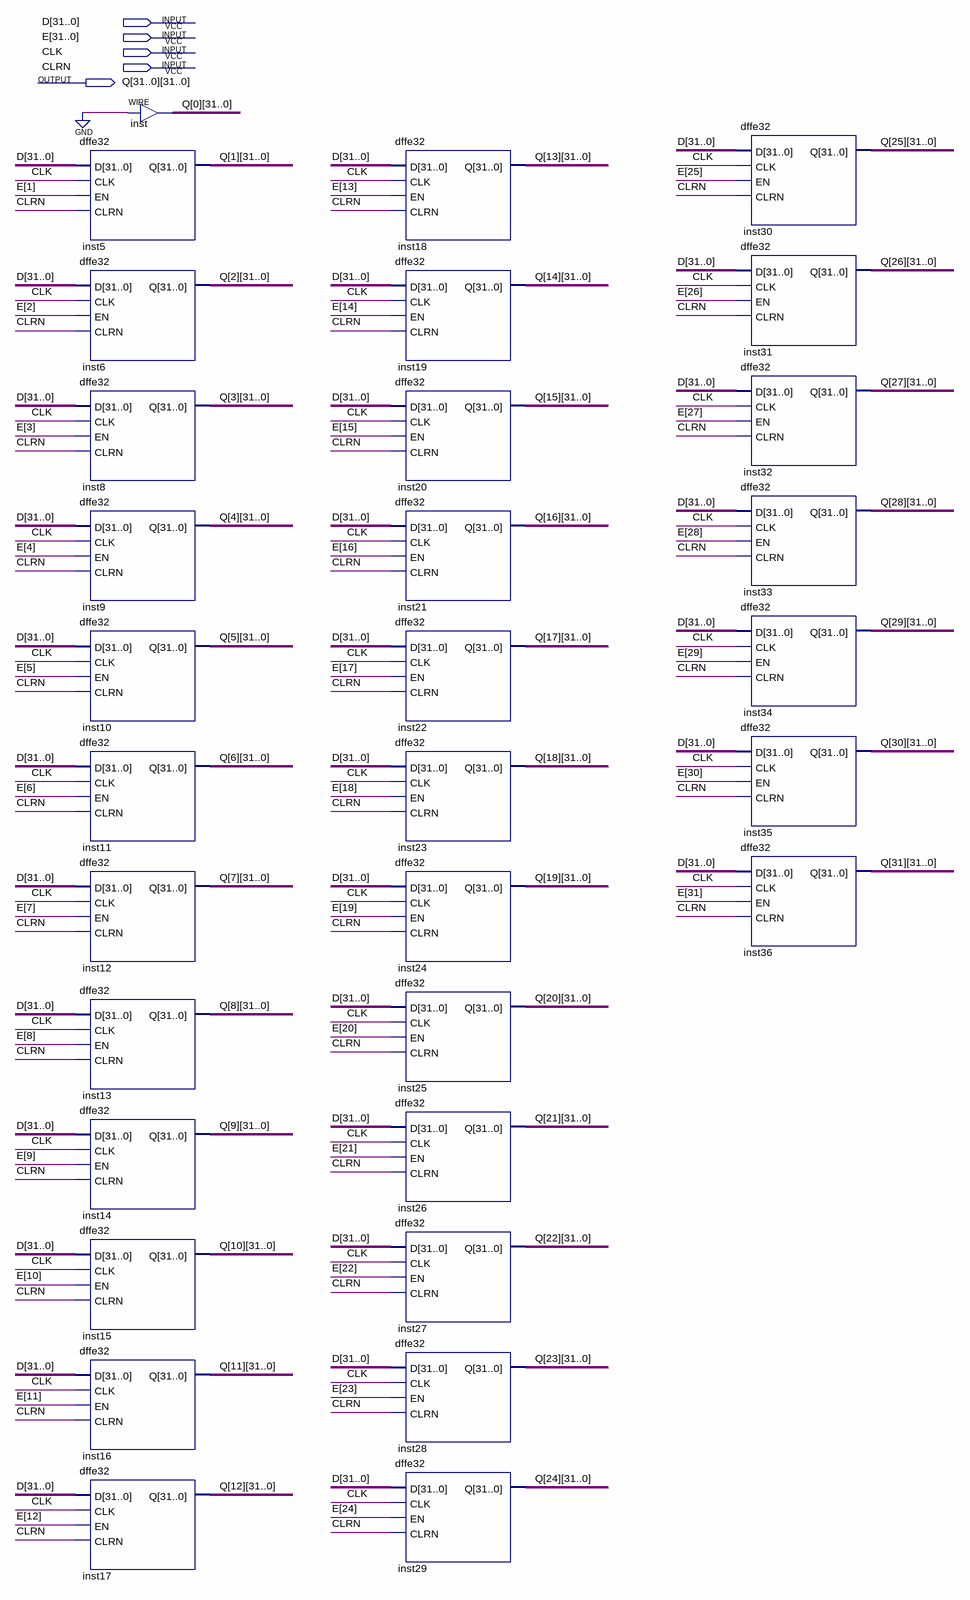
[diagram p0: schematic sheet]
// Quartus schematic reg32x32.bdf as structural Verilog: 32 symbols, 5 pins
module reg32x32 (
  input  [31:0] D,
  input  [31:0] E,
  input  CLK,
  input  CLRN,
  output [31:0] Q_31,
  output [31:0] Q_30,
  output [31:0] Q_29,
  output [31:0] Q_28,
  output [31:0] Q_27,
  output [31:0] Q_26,
  output [31:0] Q_25,
  output [31:0] Q_24,
  output [31:0] Q_23,
  output [31:0] Q_22,
  output [31:0] Q_21,
  output [31:0] Q_20,
  output [31:0] Q_19,
  output [31:0] Q_18,
  output [31:0] Q_17,
  output [31:0] Q_16,
  output [31:0] Q_15,
  output [31:0] Q_14,
  output [31:0] Q_13,
  output [31:0] Q_12,
  output [31:0] Q_11,
  output [31:0] Q_10,
  output [31:0] Q_9,
  output [31:0] Q_8,
  output [31:0] Q_7,
  output [31:0] Q_6,
  output [31:0] Q_5,
  output [31:0] Q_4,
  output [31:0] Q_3,
  output [31:0] Q_2,
  output [31:0] Q_1,
  output [31:0] Q_0
);

  dffe32 inst5 (.D(D), .CLK(CLK), .EN(E[1]), .CLRN(CLRN), .Q(Q_1));
  dffe32 inst6 (.D(D), .CLK(CLK), .EN(E[2]), .CLRN(CLRN), .Q(Q_2));
  dffe32 inst8 (.D(D), .CLK(CLK), .EN(E[3]), .CLRN(CLRN), .Q(Q_3));
  dffe32 inst9 (.D(D), .CLK(CLK), .EN(E[4]), .CLRN(CLRN), .Q(Q_4));
  dffe32 inst10 (.D(D), .CLK(CLK), .EN(E[5]), .CLRN(CLRN), .Q(Q_5));
  dffe32 inst11 (.D(D), .CLK(CLK), .EN(E[6]), .CLRN(CLRN), .Q(Q_6));
  dffe32 inst12 (.D(D), .CLK(CLK), .EN(E[7]), .CLRN(CLRN), .Q(Q_7));
  dffe32 inst13 (.D(D), .CLK(CLK), .EN(E[8]), .CLRN(CLRN), .Q(Q_8));
  dffe32 inst14 (.D(D), .CLK(CLK), .EN(E[9]), .CLRN(CLRN), .Q(Q_9));
  dffe32 inst15 (.D(D), .CLK(CLK), .EN(E[10]), .CLRN(CLRN), .Q(Q_10));
  dffe32 inst16 (.D(D), .CLK(CLK), .EN(E[11]), .CLRN(CLRN), .Q(Q_11));
  dffe32 inst17 (.D(D), .CLK(CLK), .EN(E[12]), .CLRN(CLRN), .Q(Q_12));
  assign Q_0 = {32{1'b0}};  // WIRE inst
  dffe32 inst18 (.D(D), .CLK(CLK), .EN(E[13]), .CLRN(CLRN), .Q(Q_13));
  dffe32 inst19 (.D(D), .CLK(CLK), .EN(E[14]), .CLRN(CLRN), .Q(Q_14));
  dffe32 inst20 (.D(D), .CLK(CLK), .EN(E[15]), .CLRN(CLRN), .Q(Q_15));
  dffe32 inst21 (.D(D), .CLK(CLK), .EN(E[16]), .CLRN(CLRN), .Q(Q_16));
  dffe32 inst22 (.D(D), .CLK(CLK), .EN(E[17]), .CLRN(CLRN), .Q(Q_17));
  dffe32 inst23 (.D(D), .CLK(CLK), .EN(E[18]), .CLRN(CLRN), .Q(Q_18));
  dffe32 inst24 (.D(D), .CLK(CLK), .EN(E[19]), .CLRN(CLRN), .Q(Q_19));
  dffe32 inst25 (.D(D), .CLK(CLK), .EN(E[20]), .CLRN(CLRN), .Q(Q_20));
  dffe32 inst26 (.D(D), .CLK(CLK), .EN(E[21]), .CLRN(CLRN), .Q(Q_21));
  dffe32 inst27 (.D(D), .CLK(CLK), .EN(E[22]), .CLRN(CLRN), .Q(Q_22));
  dffe32 inst28 (.D(D), .CLK(CLK), .EN(E[23]), .CLRN(CLRN), .Q(Q_23));
  dffe32 inst29 (.D(D), .CLK(CLK), .EN(E[24]), .CLRN(CLRN), .Q(Q_24));
  dffe32 inst30 (.D(D), .CLK(CLK), .EN(E[25]), .CLRN(CLRN), .Q(Q_25));
  dffe32 inst31 (.D(D), .CLK(CLK), .EN(E[26]), .CLRN(CLRN), .Q(Q_26));
  dffe32 inst32 (.D(D), .CLK(CLK), .EN(E[27]), .CLRN(CLRN), .Q(Q_27));
  dffe32 inst33 (.D(D), .CLK(CLK), .EN(E[28]), .CLRN(CLRN), .Q(Q_28));
  dffe32 inst34 (.D(D), .CLK(CLK), .EN(E[29]), .CLRN(CLRN), .Q(Q_29));
  dffe32 inst35 (.D(D), .CLK(CLK), .EN(E[30]), .CLRN(CLRN), .Q(Q_30));
  dffe32 inst36 (.D(D), .CLK(CLK), .EN(E[31]), .CLRN(CLRN), .Q(Q_31));
endmodule
